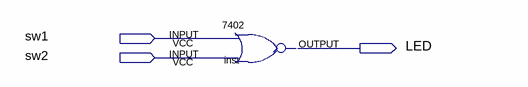
[diagram p0: schematic sheet]
// Quartus schematic Block1.bdf as structural Verilog: 1 symbols, 3 pins
module Block1 (
  input  sw1,
  input  sw2,
  output LED
);

  \7402  inst (.\2 (sw1), .\3 (sw2), .\1 (LED));
endmodule
